# Altium schematic sheet Peripherals.SchDoc
size A3
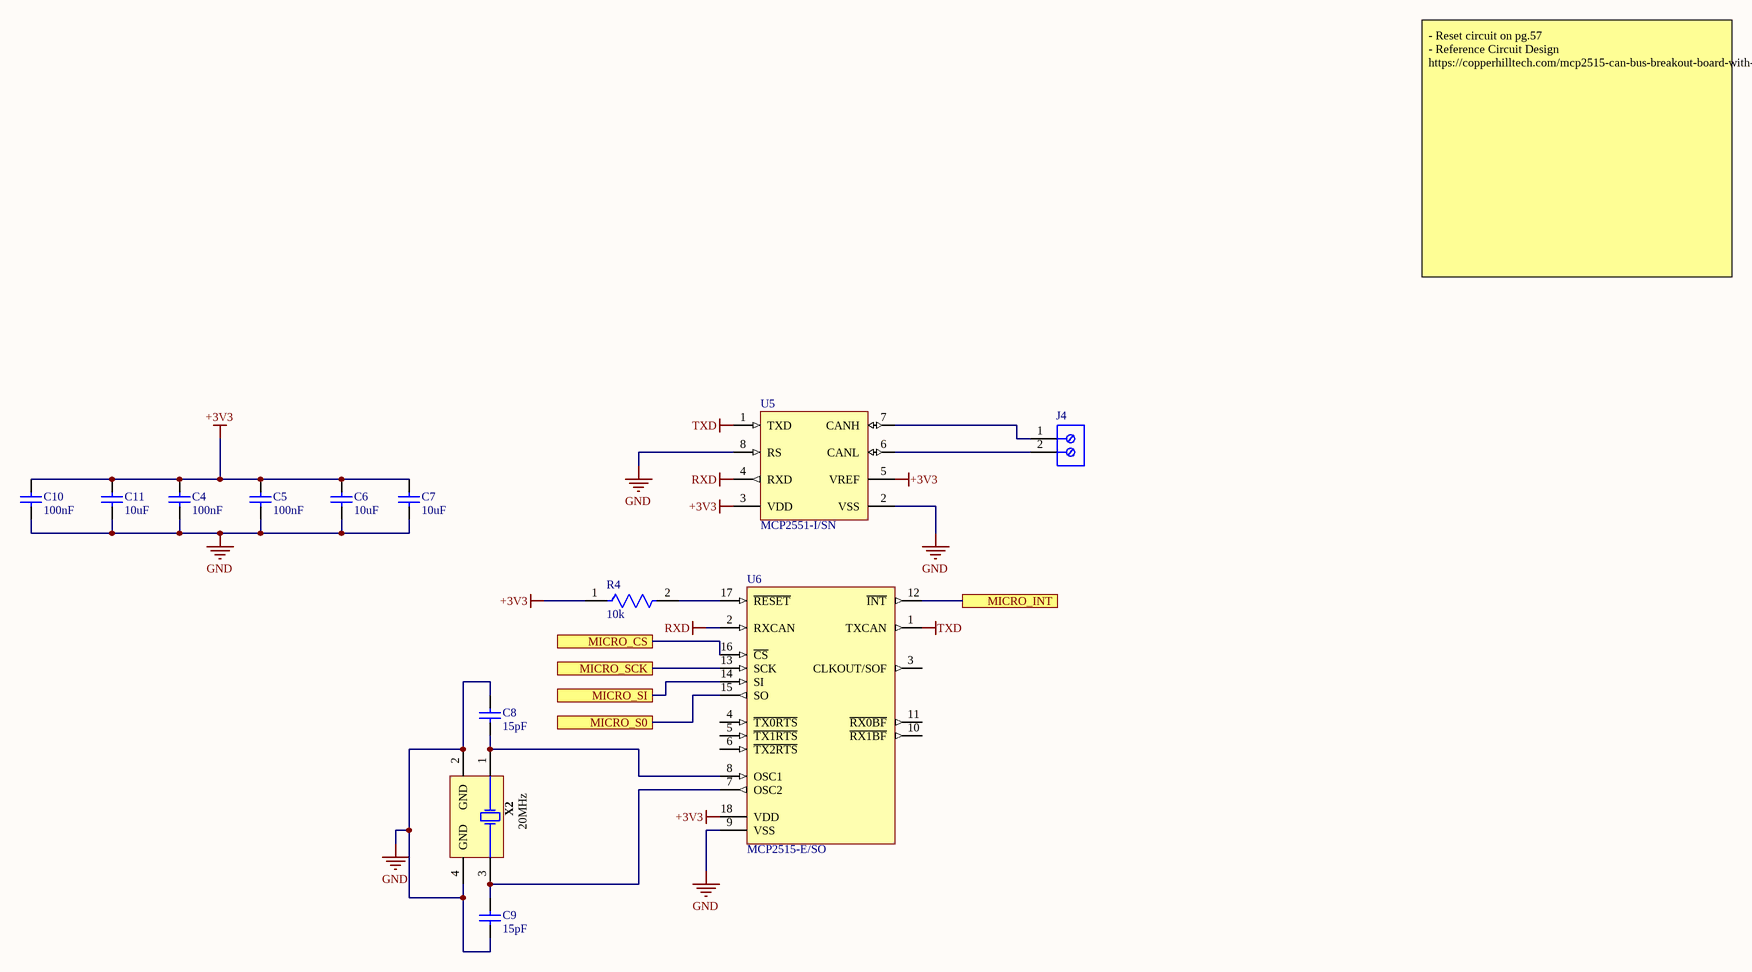
[diagram p0: Peripherals.SchDoc]

## Parts
C4  100nF  [CAPC2013X94X50ML20T25]
C5  100nF  [CAPC2013X94X50ML20T25]
C6  10uF  [CAPC2013X115X51LL20T26]
C7  10uF  [CAPC2013X115X51LL20T26]
C8  15pF  [CAPC2013X94X50NL20T25]
C9  15pF  [CAPC2013X94X50NL20T25]
C10  100nF  [CAPC2013X94X50ML20T25]
C11  10uF  [CAPC2013X115X51LL20T26]
J4  (no value)  [691214110002]
R4  10k  [FP-AC0805-MFG]
U5  MCP2551-I/SN  [MCHP-SN8_V]
U6  MCP2515-E/SO  [SOIC-SO18_M]
X2  20MHz  [TXC-7B-4_V]

## Ports
MICRO_CS, MICRO_INT, MICRO_S0, MICRO_SCK, MICRO_SI

## Nets
+3V3: C4.2 C5.2 C6.2 C7.2 C10.2 C11.2 R4.1 U5.3(VDD) U5.5(VREF) U6.18(VDD)
GND: C4.1 C5.1 C6.1 C7.1 C8.2 C9.1 C10.1 C11.1 U5.2(VSS) U5.8(RS) U6.9(VSS) X2.2(GND) X2.4(GND)
RXD: U5.4(RXD) U6.2(RXCAN)
TXD: U5.1(TXD) U6.1(TXCAN)
MICRO_CS: U6.16(~{CS}) ; port MICRO_CS
MICRO_INT: U6.12(~{INT}) ; port MICRO_INT
MICRO_S0: U6.15(SO) ; port MICRO_S0
MICRO_SCK: U6.13(SCK) ; port MICRO_SCK
MICRO_SI: U6.14(SI) ; port MICRO_SI
NetC8_1: C8.1 U6.8(OSC1) X2.1(X1)
NetC9_2: C9.2 U6.7(OSC2) X2.3(X2)
NetJ4_1: J4.1 U5.7(CANH)
NetJ4_2: J4.2 U5.6(CANL)
NetR4_2: R4.2 U6.17(~{RESET})

Not connected (* = marked no-connect by the designer): U6 3(CLKOUT/SOF) 4(~{TX0RTS}) 5(~{TX1RTS}) 6(~{TX2RTS}) 10(~{RX1BF}) 11(~{RX0BF})

## Notes on the sheet
- - Reset circuit on pg.57
  - Reference Circuit Design https://copperhilltech.com/mcp2515-can-bus-breakout-board-with-spi-interface/
- Title
- Size:
- Date:
- A3
- Number:
- Time:
- Revision:
- Sheet
- of
- File:

## Library data of the parts
C4 C5 C10 = CMP-1036-04427-2: Manufacturer: AVX Interconnect / Elco; Part Number: 08051C104JAT2A
C6 C7 C11 = CMP-2007-04884-1: Manufacturer: AVX Interconnect / Elco; Part Number: 08056C106KAT2A
C8 C9 = CMP-1036-01049-2: Part Number: 08051A150FAT2A; Manufacturer: AVX Interconnect / Elco
J4 = CMP-1502-02464-1: Serie 2141 - 3.50 mm Horizontal Entry Modular with Rising Cage Clamp WR-TBL, 2 pin; Manufacturer: Wurth Elektronik; Pin Number: 2; Pitch: 3.50mm; Datasheet URL: http://katalog.we-online.de/em/datasheet/6912141100xx.pdf; Packaging: Box; Mounting Technology: THT; Package Reference: 691214110002; Manufacturer URL: http://www.we-online.de; Part Number: 691214110002; Publisher: WurthElektronik; Operating Temperature: -40to105degC
R4 = CMP-2001-04480-2: RES SMD 10K OHM 1% 1/8W 0805; Manufacturer Part Number: AC0805FR-0710KL; Manufacturer: Yageo; Voltage Rating: 150V; Automotive Grade: Grade 0; Resistance: 10KΩ; Value: 10KΩ; Tolerance: 0.01; Temperature: -55°C to +155°C; Device Class L2: Resistors; RoHS: TRUE; Octopart: https://octopart.com/ac0805fr-0710kl-yageo-21711112; Ipc Land Pattern Name: RESC200125X50; ComponentLink2Description: Datasheet; Footprint Url: http://www.yageo.com/exep/pages/download/literatures/PYu-R_Mount_10.pdf; Temperature Range High: +155°C; Digikey Description: RES SMD 10K OHM 1% 1/8W 0805; Package: AC0805; Automotive: Yes; Mouser Description: Res Thick Film 0805 10K Ohm 1% 0.125W(1/8W) ±100ppm/C Epoxy Pad SMD Automotive T/R; Series: AC; ComponentLink2URL: http://www.yageo.com/documents/recent/PYu-AC_51_RoHS_L_6.pdf; Composition: Thick Film; Device Class L3: Chip SMD Resistors; Temperature Range Low: -55°C; Power Rating: 1/8W; Device Class L1: Passive Components; Height: 0.6mm; Lead Free: Yes; Category: Res
U5 = CMP-0186-00138-3: High-Speed CAN Transceiver, / 1 Mb/s, 4.5 to 5.5 V, 8-Pin SOIC (SN), Industrial Temperature, RoHS, Tube; Manufacturer: Microchip; RoHSCompliant: true; PackageReference: SN8; ComponentLink1URL: http://www.microchip.com/; DatasheetVersion: Rev. F, 07/2010; ComponentLink2Description: Datasheet; ComponentLink2URL: http://ww1.microchip.com/downloads/en/DeviceDoc/21667f.pdf; ComponentLink3Description: Package Specification; PackageDescription: 8-Pin Small Outline Integrated Circuit, Body 4.9 x 3.9 mm, Pitch 1.27 mm; ComponentLink1Description: Manufacturer URL; Mounting Technology: Surface Mount; ComponentLink3URL: http://www.microchip.com/stellent/groups/techpub_sg/documents/packagingspec/en012702.pdf
U6 = CMP-0186-00035-2: Stand-Alone CAN Controller With SPI Interface, 18-Pin SOIC, Extended Temperature; RevisionNote: URLs added. DatasheetVersion updated.; DatasheetVersion: revF, Oct-2010; ComponentLink2Description: Datasheet; ComponentLink3Description: Package Specification; ComponentLink1Description: Manufacturer URL; PackageReference: SOIC-SO18; PackageDescription: 18-Lead Plastic Small Outline (SO) - Wide 7.50mm Body [SOIC]; PackageVersion: revBB, Aug-2009; ComponentLink1URL: http://www.microchip.com/; ComponentLink3URL: http://www.microchip.com/stellent/groups/techpub_sg/documents/packagingspec/en012702.pdf; ComponentLink2URL: http://ww1.microchip.com/downloads/en/DeviceDoc/21801f.pdf; Code_JEDEC: MS-013
X2 = CMP-1774-00008-1: SMD Seam Sealing Crystal, 20 MHz, +/- 30 ppm, 18 pF, -10 to 70 degC, 4-Pin SMD, RoHS, Tape and Reel; Peak Reverse Current: 2 uA; Recovery Time: 5 ns; Elements: 2; Max Power Dissipation: 200 mW; Forward Current: 200 mA; Case\Package: TO-236-3; Forward Voltage: 800 mV; Max Surge Current: 600 mA; Element Configuration: Common Cathode; Width: 0.85 mm; Length: 1.7 mm; Pins: 3; RoHSCompliant: true; Min Operating Temperature: -65 degC; Mount: Surface Mount; Height: 0.8 mm; Packaging: Tape and Reel; PackageReference: 7B-4; Package Quantity: 3000; Max Operating Temperature: 125 degC; Radiation Hardening: No; PackageDescription: 4-Pin Surface Mount Device, Body 5 x 3.2 mm, Pitch 3.7 mm; ComponentLink1Description: Datasheet; REACH SVHC: No SVHC; ComponentLink1URL: http://www.txccorp.com/download/products/quartz_crystals/2015TXC_7B_19.pdf; DatasheetVersion: Jul-15